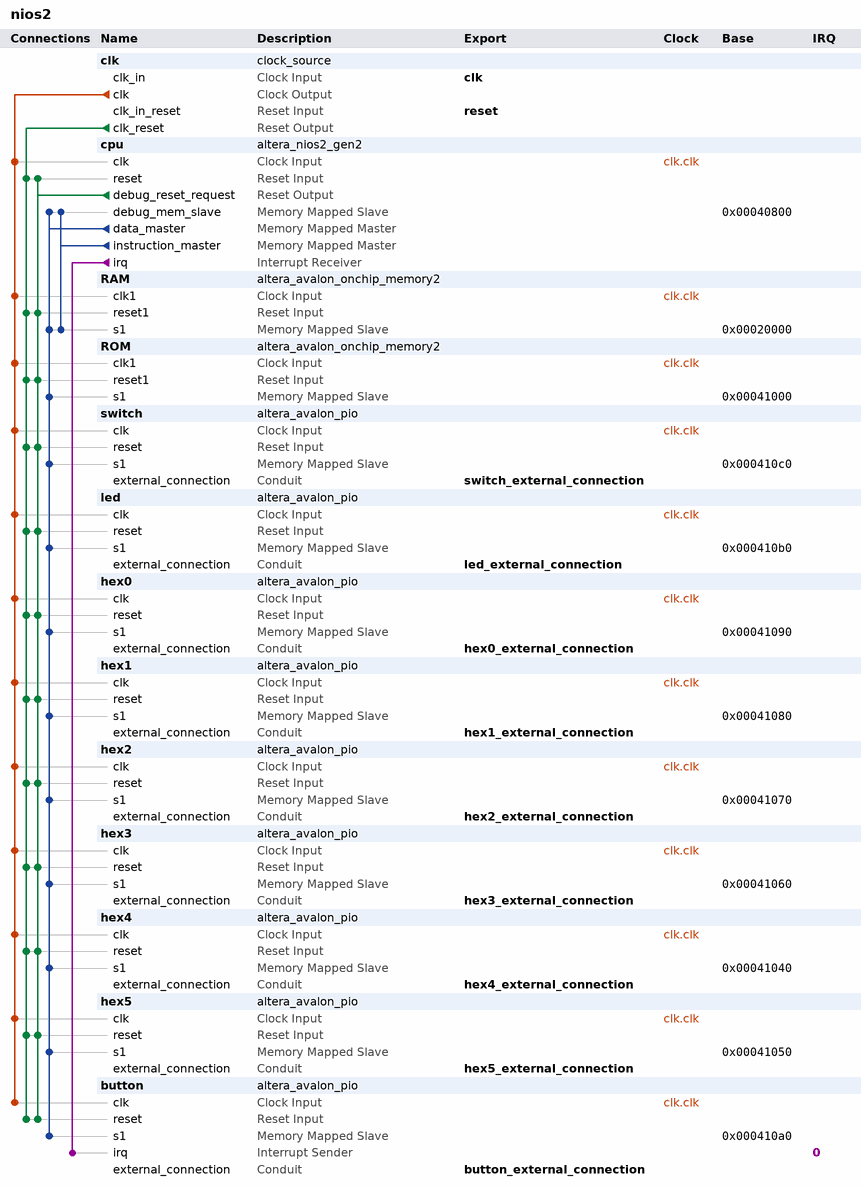
[diagram p0: system contents]
# Platform Designer (Qsys) system nios2, Cyclone V 5CGXFC7C7F23C8
# Parameters at their usual value, and those the tool derives, are not listed.
package require -exact qsys 18.0
create_system nios2
set_project_property DEVICE_FAMILY {Cyclone V}
set_project_property DEVICE 5CGXFC7C7F23C8

add_instance clk clock_source 18.0
set_instance_parameter_value clk clockFrequency 50000000

add_instance cpu altera_nios2_gen2 18.0
set_instance_parameter_value cpu dcache_size 2048
set_instance_parameter_value cpu exceptionSlave RAM.s1
set_instance_parameter_value cpu icache_size 4096
set_instance_parameter_value cpu impl Tiny
set_instance_parameter_value cpu resetSlave RAM.s1

add_instance RAM altera_avalon_onchip_memory2 18.0
set_instance_parameter_value RAM dataWidth 32
set_instance_parameter_value RAM dualPort false
set_instance_parameter_value RAM initMemContent true
set_instance_parameter_value RAM initializationFileName E:/My_studies/3rd_year/Internship/Training/max10_nios2_interrupt/nios2_RAM.hex
set_instance_parameter_value RAM memorySize 102400
set_instance_parameter_value RAM useNonDefaultInitFile true

add_instance ROM altera_avalon_onchip_memory2 18.0
set_instance_parameter_value ROM dataWidth 16
set_instance_parameter_value ROM dualPort false
set_instance_parameter_value ROM initMemContent true
set_instance_parameter_value ROM initializationFileName E:/My_studies/3rd_year/Internship/Training/max10_nios2_interrupt/nios2_ROM.hex
set_instance_parameter_value ROM memorySize 64
set_instance_parameter_value ROM useNonDefaultInitFile true
set_instance_parameter_value ROM writable false

add_instance switch altera_avalon_pio 18.0
set_instance_parameter_value switch direction Input
set_instance_parameter_value switch width 10

add_instance led altera_avalon_pio 18.0
set_instance_parameter_value led direction Output
set_instance_parameter_value led width 10

add_instance hex0 altera_avalon_pio 18.0
set_instance_parameter_value hex0 direction Output
set_instance_parameter_value hex0 resetValue 127
set_instance_parameter_value hex0 width 8

add_instance hex1 altera_avalon_pio 18.0
set_instance_parameter_value hex1 direction Output
set_instance_parameter_value hex1 resetValue 64
set_instance_parameter_value hex1 width 8

add_instance hex2 altera_avalon_pio 18.0
set_instance_parameter_value hex2 direction Output
set_instance_parameter_value hex2 resetValue 199
set_instance_parameter_value hex2 width 8

add_instance hex3 altera_avalon_pio 18.0
set_instance_parameter_value hex3 direction Output
set_instance_parameter_value hex3 resetValue 199
set_instance_parameter_value hex3 width 8

add_instance hex4 altera_avalon_pio 18.0
set_instance_parameter_value hex4 direction Output
set_instance_parameter_value hex4 resetValue 134
set_instance_parameter_value hex4 width 8

add_instance hex5 altera_avalon_pio 18.0
set_instance_parameter_value hex5 direction Output
set_instance_parameter_value hex5 resetValue 137
set_instance_parameter_value hex5 width 8

add_instance button altera_avalon_pio 18.0
set_instance_parameter_value button direction Input
set_instance_parameter_value button generateIRQ true
set_instance_parameter_value button width 1

# connections
add_connection clk.clk button.clk clock
add_connection clk.clk cpu.clk clock
add_connection clk.clk hex0.clk clock
add_connection clk.clk hex1.clk clock
add_connection clk.clk hex2.clk clock
add_connection clk.clk hex3.clk clock
add_connection clk.clk hex4.clk clock
add_connection clk.clk hex5.clk clock
add_connection clk.clk led.clk clock
add_connection clk.clk RAM.clk1 clock
add_connection clk.clk ROM.clk1 clock
add_connection clk.clk switch.clk clock
add_connection clk.clk_reset button.reset reset
add_connection clk.clk_reset cpu.reset reset
add_connection clk.clk_reset hex0.reset reset
add_connection clk.clk_reset hex1.reset reset
add_connection clk.clk_reset hex2.reset reset
add_connection clk.clk_reset hex3.reset reset
add_connection clk.clk_reset hex4.reset reset
add_connection clk.clk_reset hex5.reset reset
add_connection clk.clk_reset led.reset reset
add_connection clk.clk_reset RAM.reset1 reset
add_connection clk.clk_reset ROM.reset1 reset
add_connection clk.clk_reset switch.reset reset
add_connection cpu.debug_reset_request button.reset reset
add_connection cpu.debug_reset_request cpu.reset reset
add_connection cpu.debug_reset_request hex0.reset reset
add_connection cpu.debug_reset_request hex1.reset reset
add_connection cpu.debug_reset_request hex2.reset reset
add_connection cpu.debug_reset_request hex3.reset reset
add_connection cpu.debug_reset_request hex4.reset reset
add_connection cpu.debug_reset_request hex5.reset reset
add_connection cpu.debug_reset_request led.reset reset
add_connection cpu.debug_reset_request RAM.reset1 reset
add_connection cpu.debug_reset_request ROM.reset1 reset
add_connection cpu.debug_reset_request switch.reset reset
add_connection cpu.data_master button.s1 avalon
set_connection_parameter_value cpu.data_master/button.s1 baseAddress 0x000410a0
add_connection cpu.data_master cpu.debug_mem_slave avalon
set_connection_parameter_value cpu.data_master/cpu.debug_mem_slave baseAddress 0x00040800
add_connection cpu.data_master hex0.s1 avalon
set_connection_parameter_value cpu.data_master/hex0.s1 baseAddress 0x00041090
add_connection cpu.data_master hex1.s1 avalon
set_connection_parameter_value cpu.data_master/hex1.s1 baseAddress 0x00041080
add_connection cpu.data_master hex2.s1 avalon
set_connection_parameter_value cpu.data_master/hex2.s1 baseAddress 0x00041070
add_connection cpu.data_master hex3.s1 avalon
set_connection_parameter_value cpu.data_master/hex3.s1 baseAddress 0x00041060
add_connection cpu.data_master hex4.s1 avalon
set_connection_parameter_value cpu.data_master/hex4.s1 baseAddress 0x00041040
add_connection cpu.data_master hex5.s1 avalon
set_connection_parameter_value cpu.data_master/hex5.s1 baseAddress 0x00041050
add_connection cpu.data_master led.s1 avalon
set_connection_parameter_value cpu.data_master/led.s1 baseAddress 0x000410b0
add_connection cpu.data_master RAM.s1 avalon
set_connection_parameter_value cpu.data_master/RAM.s1 baseAddress 0x00020000
add_connection cpu.data_master ROM.s1 avalon
set_connection_parameter_value cpu.data_master/ROM.s1 baseAddress 0x00041000
add_connection cpu.data_master switch.s1 avalon
set_connection_parameter_value cpu.data_master/switch.s1 baseAddress 0x000410c0
add_connection cpu.instruction_master cpu.debug_mem_slave avalon
set_connection_parameter_value cpu.instruction_master/cpu.debug_mem_slave baseAddress 0x00040800
add_connection cpu.instruction_master RAM.s1 avalon
set_connection_parameter_value cpu.instruction_master/RAM.s1 baseAddress 0x00020000
add_connection cpu.irq button.irq interrupt
set_connection_parameter_value cpu.irq/button.irq irqNumber 0

# exported interfaces
add_interface button_external_connection conduit end
set_interface_property button_external_connection EXPORT_OF button.external_connection
add_interface clk clock sink
set_interface_property clk EXPORT_OF clk.clk_in
add_interface hex0_external_connection conduit end
set_interface_property hex0_external_connection EXPORT_OF hex0.external_connection
add_interface hex1_external_connection conduit end
set_interface_property hex1_external_connection EXPORT_OF hex1.external_connection
add_interface hex2_external_connection conduit end
set_interface_property hex2_external_connection EXPORT_OF hex2.external_connection
add_interface hex3_external_connection conduit end
set_interface_property hex3_external_connection EXPORT_OF hex3.external_connection
add_interface hex4_external_connection conduit end
set_interface_property hex4_external_connection EXPORT_OF hex4.external_connection
add_interface hex5_external_connection conduit end
set_interface_property hex5_external_connection EXPORT_OF hex5.external_connection
add_interface led_external_connection conduit end
set_interface_property led_external_connection EXPORT_OF led.external_connection
add_interface reset reset sink
set_interface_property reset EXPORT_OF clk.clk_in_reset
add_interface switch_external_connection conduit end
set_interface_property switch_external_connection EXPORT_OF switch.external_connection

set_interconnect_requirement {$system} qsys_mm.clockCrossingAdapter HANDSHAKE
set_interconnect_requirement {$system} qsys_mm.enableEccProtection FALSE
set_interconnect_requirement {$system} qsys_mm.insertDefaultSlave FALSE
set_interconnect_requirement {$system} qsys_mm.maxAdditionalLatency 1

save_system nios2.qsys
